# EasyEDA Pro project ICM42688-P.epro

# Schematic RareCheese
Create Date: 2023-12-05; Page Name: ICM42688; Project Name: SlimeVR-CheeseCake; Schematic Name: RareCheese; Update Date: 2023-12-05; Company: Designed by SoraKage; Page Size: A4; Version: V2.3
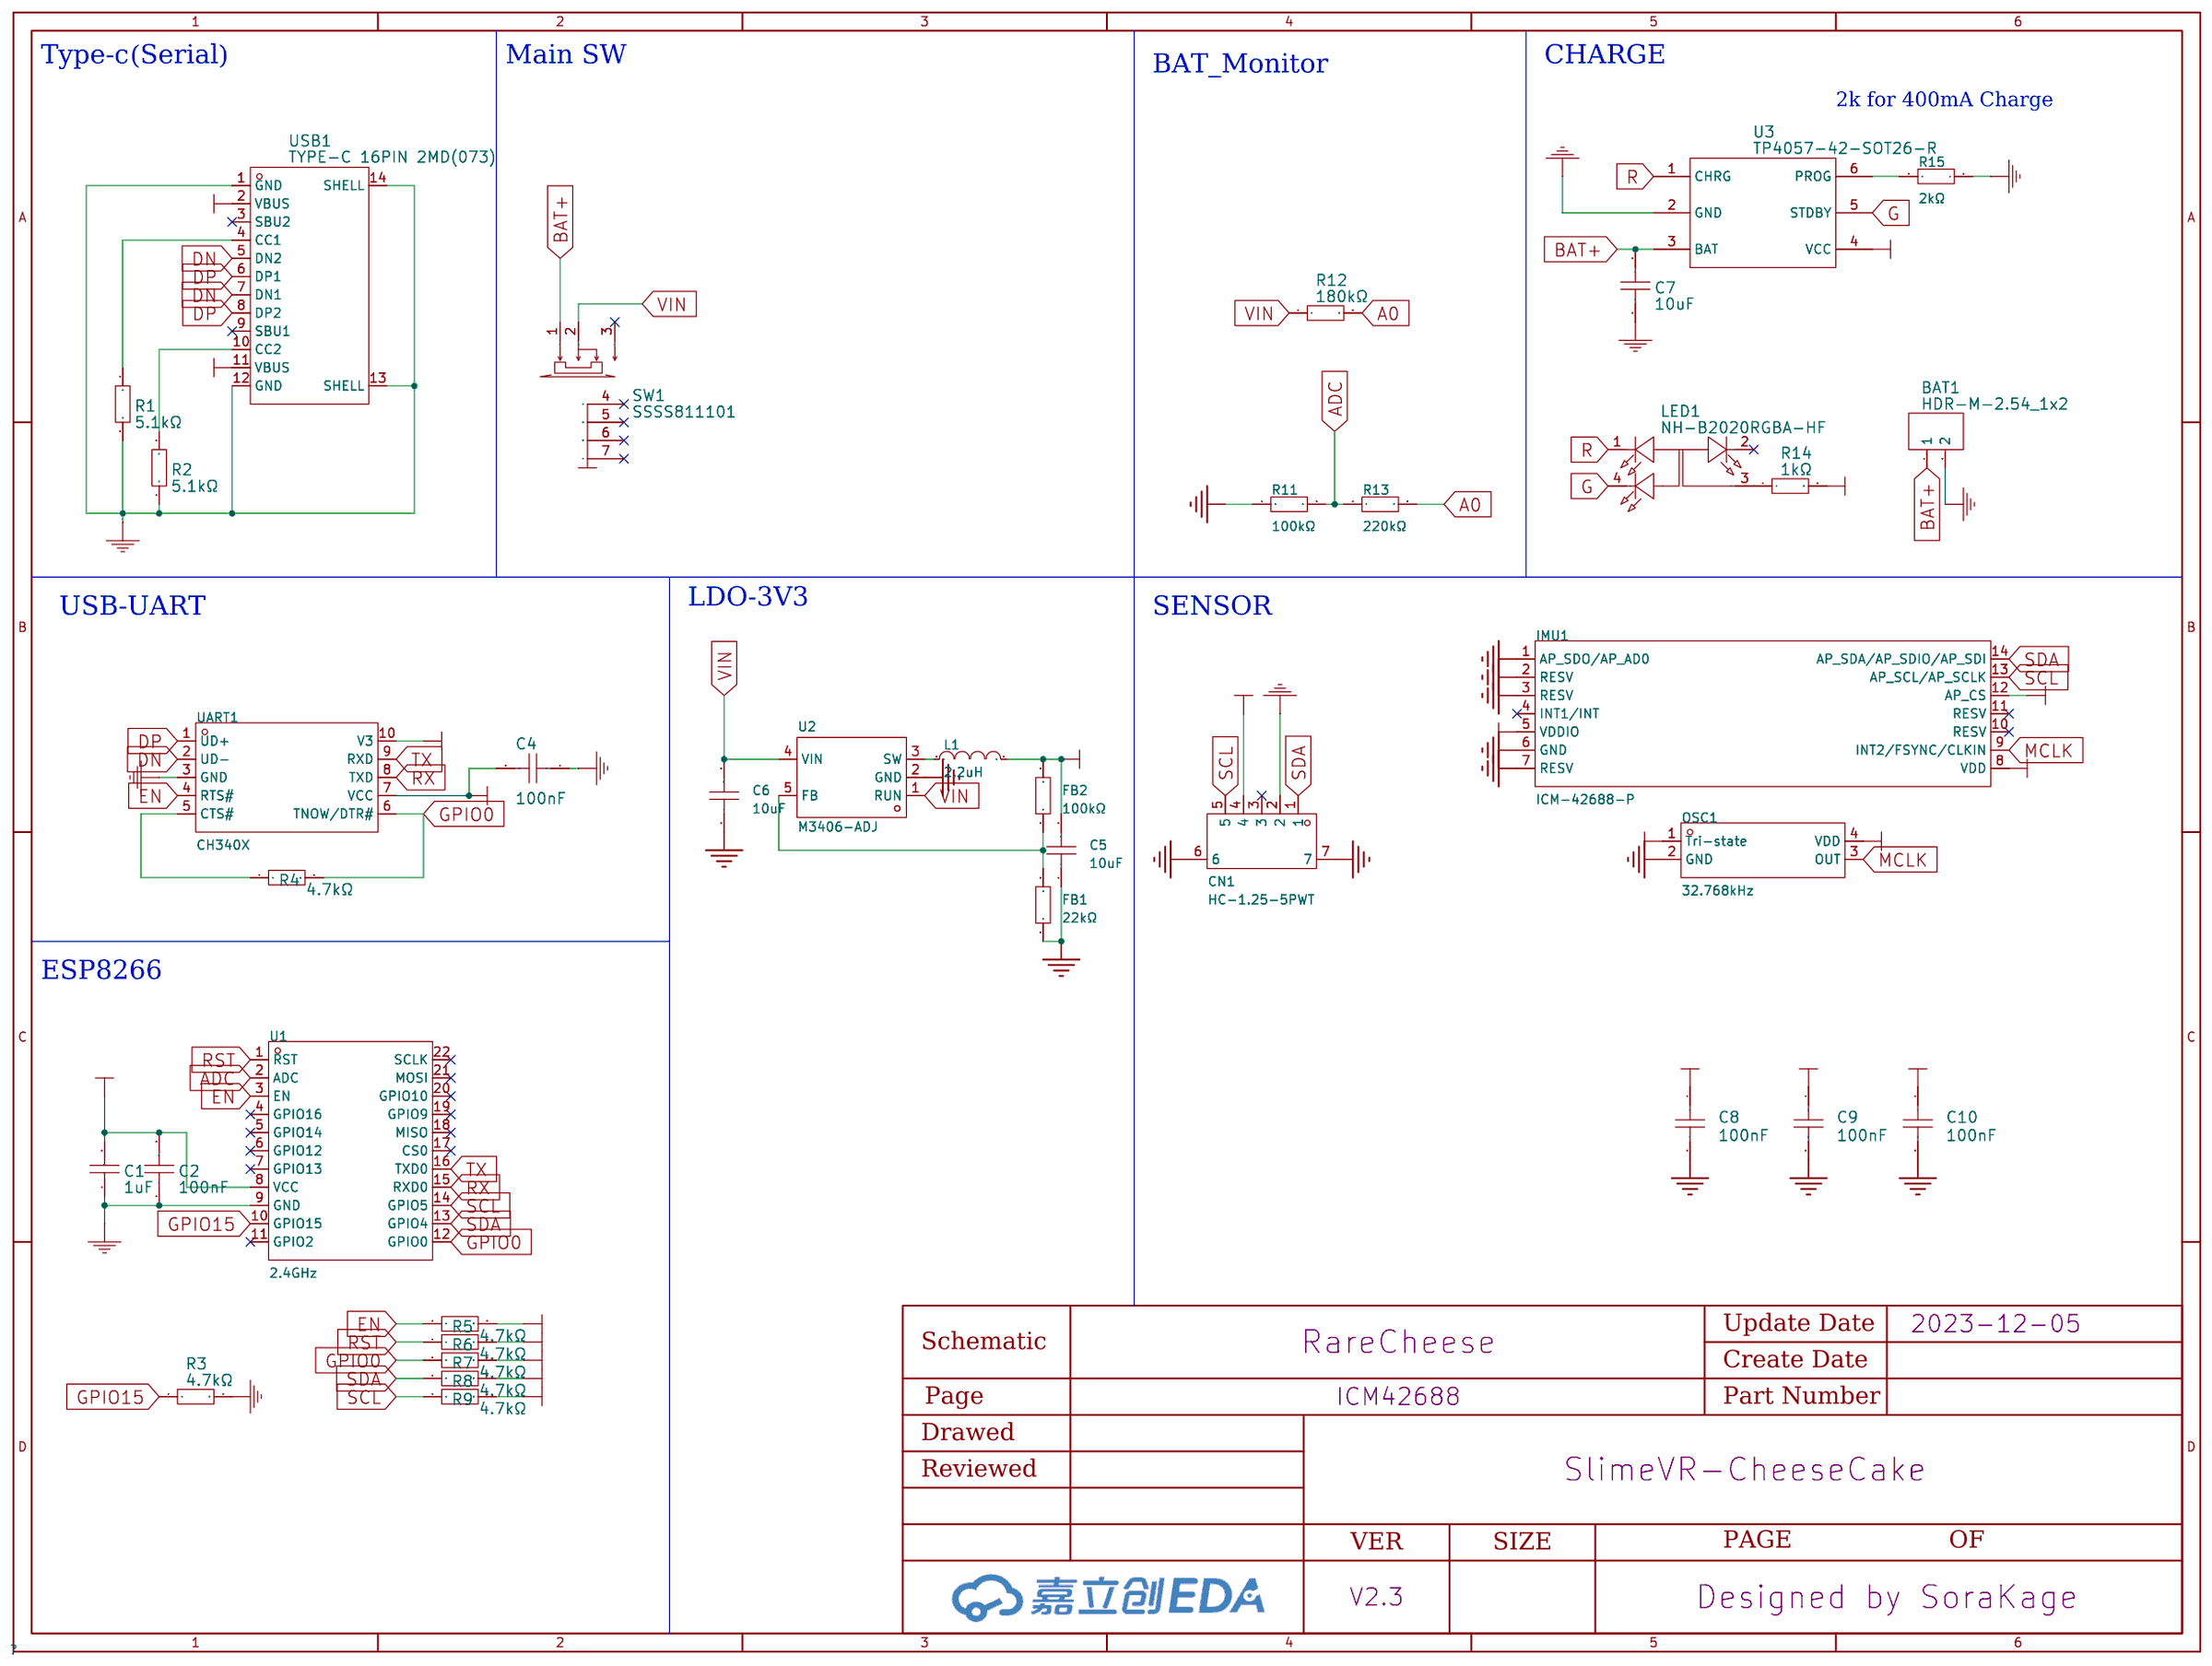
[diagram p0: schematic sheet]

## Parts
BAT1  HDR-M-2.54_1x2  [HDR-M-2.54_1X2]
C1  1uF  [C0603]
C2  100nF  [C0603]
C4  100nF  [C0603]
C5  10uF  [C0603]
C6  10uF  [C0603]
C7  10uF  [C0603]
C8  100nF  [C0603]
C9  100nF  [C0603]
C10  100nF  [C0603]
CN1  HC-1.25-5PWT  [CONN-SMD_5P-P1.25_HCTL_HC-1.25-5PWT]
FB1  22kΩ  [R0402]
FB2  100kΩ  [R0402]
IMU1  ICM-42688-P  [LGA-14_L3.0-W2.5-P0.50-TL]
L1  2.2uH  [IND-SMD_L2.5-W2.0_YXMBL252010P]
LED1  NH-B2020RGBA-HF  [LED-ARRAY-SMD_4P-L2.1-W2.1-TL_NH-B2020RGBA]
OSC1  32.768kHz  [OSC-SMD_4P-L3.2-W2.5-BL]
R1  5.1kΩ  [R0603]
R2  5.1kΩ  [R0603]
R3  4.7kΩ  [R0603]
R4  4.7kΩ  [R0603]
R5  4.7kΩ  [R0603]
R6  4.7kΩ  [R0603]
R7  4.7kΩ  [R0603]
R8  4.7kΩ  [R0603]
R9  4.7kΩ  [R0603]
R11  100kΩ  [R0603]
R12  180kΩ  [R0603]
R13  220kΩ  [R0603]
R14  1kΩ  [R0603]
R15  2kΩ  [R0603]
SW1  SSSS811101  [SW-SMD_SSSS811101]
U1  2.4GHz  [WIFIM-SMD_ESP-12F-ESP8266MOD]
U2  M3406-ADJ  [SOT-23-5_L3.0-W1.7-P0.95-LS2.8-BR]
U3  TP4057-42-SOT26-R  [SOT-23-6_L2.9-W1.6-P0.95-LS2.8-BL]
UART1  CH340X  [MSOP-10_L3.0-W3.0-P0.50-LS5.0-BL]
USB1  TYPE-C 16PIN 2MD(073)  [USB-C-SMD_TYPE-C-6PIN-2MD-073]

## Library data of the parts
BAT1 = HDR-M-2.54_1x2: Supplier Part: C124375; Supplier: LCSC
C1 = 1uF: link: https://item.szlcsc.com/362304.html; 3DModel: C0603_L1.6-W0.8-H0.8; Supplier: LCSC; Manufacturer Part: CL10A105KB8NNNC; Manufacturer: SAMSUNG(三星); Supplier Part: C15849; JLCPCB Part Class: Basic Part
C2 C4 C8-C10 = 100nF: link: https://item.szlcsc.com/362304.html; 3DModel: C0603_L1.6-W0.8-H0.8; Supplier: LCSC; Manufacturer: YAGEO(国巨); Manufacturer Part: CC0603KRX7R9BB104; Supplier Part: C14663; JLCPCB Part Class: Basic Part
C5 C6 = CL10A106KP8NNNC: 容值:10uF;精度:±10%;额定电压:10V;材质(温度系数):X5R;; LCSC Part Name: 10uF ±10% 10V; Supplier Part: C19702; Manufacturer: SAMSUNG(三星); Supplier Footprint: 0603; JLCPCB Part Class: 基础库; Datasheet: https://atta.szlcsc.com/upload/public/pdf/source/20160103/1457707703378.pdf; Supplier: LCSC; Tolerance: ±10%; Voltage Rated: 10V; Temperature Coefficient: X5R
C7 = 10uF: link: https://item.szlcsc.com/362304.html; 3DModel: C0603_L1.6-W0.8-H0.8; Supplier: LCSC; Manufacturer: SAMSUNG(三星); Manufacturer Part: CL10A106KP8NNNC; Supplier Part: C19702; JLCPCB Part Class: Basic Part
CN1 = HC-1.25-5PWT: 参考系列:-;间距:1.25mm;插针结构:1x5P;排数:1;每排PIN数:5;行距:-;公母:公型插针;安装方式:卧贴;额定电流:1A;工作温度范围:-25℃~+85℃;; LCSC Part Name: 1.25mm 1x5P 卧贴; Supplier Part: C2845382; Manufacturer: HCTL(华灿天禄); Supplier Footprint: SMD,P=1.25mm; JLCPCB Part Class: Extended Part; Datasheet: https://atta.szlcsc.com/upload/public/pdf/source/20210728/C2845379_48B7DC28A4B35DB030A7253F7C3FD974.pdf; Supplier: LCSC; Pitch: 1.25mm; Pins Structure: 1x5P; Number of Rows: 1; Number of PINs Per Row: 5; Gender: 公型插针; Mounting Style: 卧贴; Current Rating (Max): 1A; Operating Temperature Range: -25℃~+85℃; NO_CONNECT: yes
FB1 = 0402WGF2202TCE: 电阻类型:厚膜电阻;阻值:22kΩ;精度:±1%;功率:62.5mW;; LCSC Part Name: 22kΩ ±1% 62.5mW; Supplier Part: C25768; Manufacturer: UNI-ROYAL(厚声); Supplier Footprint: 0402; JLCPCB Part Class: 基础库; Datasheet: https://atta.szlcsc.com/upload/public/pdf/source/20200306/C422600_1E6D84923E4A46A82E41ADD87F860B5C.pdf; Supplier: LCSC; Type: 厚膜电阻; Tolerance: ±1%; Power(Watts): 62.5mW; Temperature Coefficient: ±100ppm/℃; Overload Voltage (Max): 50V; Operating Temperature Range: -55℃~+155℃
FB2 = 0402WGF1003TCE: 电阻类型:厚膜电阻;阻值:100kΩ;精度:±1%;功率:62.5mW;; LCSC Part Name: 100kΩ ±1% 62.5mW; Supplier Part: C25741; Manufacturer: UNI-ROYAL(厚声); Supplier Footprint: 0402; JLCPCB Part Class: 基础库; Datasheet: https://atta.szlcsc.com/upload/public/pdf/source/20200306/C422600_1E6D84923E4A46A82E41ADD87F860B5C.pdf; Supplier: LCSC; Type: 厚膜电阻; Tolerance: ±1%; Power(Watts): 62.5mW; Temperature Coefficient: ±100ppm/℃; Overload Voltage (Max): 50V; Operating Temperature Range: -55℃~+155℃
IMU1 = ICM-42688-P: LCSC Part Name: ICM 42688 P; Supplier Part: C1850418; Manufacturer: TDK InvenSense(应美盛); Supplier Footprint: LGA-14(2.5x3); JLCPCB Part Class: 扩展库; Datasheet: https://atta.szlcsc.com/upload/public/pdf/source/20210703/CF24204867ACE5B754A2B035F23E5931.pdf; Supplier: LCSC
L1 = APH252010T2R2M: 类型:一体成型电感;电感值:2.2uH;精度:±20%;额定电流:2.1A;饱和电流(Isat):3A;; LCSC Part Name: 2.2uH ±20% 3A; Supplier Part: C5349606; Manufacturer: APV(爱普微); Supplier Footprint: L252010; JLCPCB Part Class: 扩展库; Datasheet: https://atta.szlcsc.com/upload/public/pdf/source/20230112/CD71A991BF44148C80048C09E1A9BC6B.pdf; Supplier: LCSC; Type: 一体成型电感; Tolerance: ±20%; Rated Current: 2.1A; Saturation Current (Isat): 3A; DC Resistance (DCR): 70mΩ
LED1 = NH-B2020RGBA-HF: link: https://atta.szlcsc.com/upload/public/pdf/source/20210810/F2CC95523506BC87574AF0308E7F77A3.pdf; Supplier: LCSC; Supplier Part: C2874116; Manufacturer: 国星光电; JLCPCB Part Class: Extended Part
OSC1 = OK2EL89CJI-111YLC-32.768K: 频率:32.768kHz;工作电压:1.8V~3.3V;; LCSC Part Name: 32.768KHZ 1.8V-3.3V ±10PPM YSO120TK; Supplier Part: C5280579; Manufacturer: YXC(扬兴晶振); Supplier Footprint: SMD3225-4P; JLCPCB Part Class: 扩展库; Datasheet: https://atta.szlcsc.com/upload/public/pdf/source/20221123/314DEFB66F8D0824EF78ADB5B539B6E4.pdf; Supplier: LCSC; Supply Voltage: 1.8V~3.3V
R1 R2 = 5.1kΩ: 3DModel: R0603_L1.6-W0.8-H0.8; link: https://www.mouser.in/datasheet/2/447/PYu_RT_1_to_0_01_RoHS_L_11-1669912.pdf; Supplier: LCSC; Manufacturer Part: 0603WAF5101T5E; Manufacturer: UNI-ROYAL(厚声); Supplier Part: C23186; Resistance: 5.1K; JLCPCB Part Class: Basic Part
R3 R5-R7 = 4.7kΩ: 3DModel: R0603_L1.6-W0.8-H0.8; link: https://www.mouser.in/datasheet/2/447/PYu_RT_1_to_0_01_RoHS_L_11-1669912.pdf; Supplier: LCSC; Manufacturer: UNI-ROYAL(厚声); Manufacturer Part: 0603WAF4701T5E; Supplier Part: C23162; Resistance: 4.7K; JLCPCB Part Class: Basic Part
R4 R8 R9 = 0603WAF4701T5E: Supplier: LCSC; Manufacturer: UNI-ROYAL(厚声); Supplier Part: C23162; Resistance: 4.7K; JLCPCB Part Class: Basic Part
R11 = 0603WAF1003T5E: 电阻类型:厚膜电阻;阻值:100kΩ;精度:±1%;功率:100mW;; LCSC Part Name: 100kΩ ±1% 100mW; Supplier Part: C25803; Manufacturer: UNI-ROYAL(厚声); Supplier Footprint: 0603; JLCPCB Part Class: Basic Part; Datasheet: https://atta.szlcsc.com/upload/public/pdf/source/20200306/C422600_1E6D84923E4A46A82E41ADD87F860B5C.pdf; Supplier: LCSC; Type: 厚膜电阻; Tolerance: ±1%; Power(Watts): 100mW; Temperature Coefficient: ±100ppm/℃; Overload Voltage (Max): 75V; Operating Temperature Range: -55℃~+155℃
R12 = 180kΩ: 3DModel: R0603_L1.6-W0.8-H0.8; link: https://www.mouser.in/datasheet/2/447/PYu_RT_1_to_0_01_RoHS_L_11-1669912.pdf; Supplier: LCSC; Manufacturer: UNI-ROYAL(厚声); Manufacturer Part: 0603WAF1803T5E; Supplier Part: C22827; Resistance: 180K; JLCPCB Part Class: Basic Part
R13 = 0603WAF2203T5E: 电阻类型:厚膜电阻;阻值:220kΩ;精度:±1%;功率:100mW;; LCSC Part Name: 220kΩ ±1% 100mW; Supplier Part: C22961; Manufacturer: UNI-ROYAL(厚声); Supplier Footprint: 0603; JLCPCB Part Class: Basic Part; Datasheet: https://atta.szlcsc.com/upload/public/pdf/source/20200306/C422600_1E6D84923E4A46A82E41ADD87F860B5C.pdf; Supplier: LCSC; Type: 厚膜电阻; Tolerance: ±1%; Power(Watts): 100mW; Temperature Coefficient: ±100ppm/℃; Overload Voltage (Max): 75V; Operating Temperature Range: -55℃~+155℃
R14 = 1kΩ: 3DModel: R0603_L1.6-W0.8-H0.8; link: https://www.mouser.in/datasheet/2/447/PYu_RT_1_to_0_01_RoHS_L_11-1669912.pdf; Supplier: LCSC; Manufacturer: UNI-ROYAL(厚声); Manufacturer Part: 0603WAF1001T5E; Supplier Part: C21190; Resistance: 1K; JLCPCB Part Class: Basic Part
R15 = 0603WAF2001T5E: 电阻类型:厚膜电阻;阻值:2kΩ;精度:±1%;功率:100mW;; LCSC Part Name: 2kΩ ±1% 100mW; Supplier Part: C22975; Manufacturer: UNI-ROYAL(厚声); Supplier Footprint: 0603; JLCPCB Part Class: Basic Part; Datasheet: https://atta.szlcsc.com/upload/public/pdf/source/20200306/C422600_1E6D84923E4A46A82E41ADD87F860B5C.pdf; Supplier: LCSC; Type: 厚膜电阻; Tolerance: ±1%; Power(Watts): 100mW; Temperature Coefficient: ±100ppm/℃; Overload Voltage (Max): 75V; Operating Temperature Range: -55℃~+155℃
SW1 = SSSS811101: link: https://item.szlcsc.com/110556.html; 3DModel: SW-TH_SSSS811101; Supplier: LCSC; Manufacturer: ALPSALPINE(阿尔卑斯阿尔派); Supplier Part: C109335; JLCPCB Part Class: Extended Part
U1 = ESP-12F(ESP8266MOD): 频率:2.4GHz;发射功率:16dBm;核心处理器:ESP8266;天线形式:PCB 板载天线;接收灵敏度:-90dBm;; Supplier Part: C82891; Manufacturer: Ai-Thinker(安信可); Supplier Footprint: SMD,16x24mm; JLCPCB Part Class: Extended Part; Datasheet: https://atta.szlcsc.com/upload/public/pdf/source/20210219/C82891_ABD84A460F4F056A2757267CCCA4B508.pdf; Supplier: LCSC; Output Power: 16dBm; Core Processor: ESP8266; Support Interface: GPIO；UART；I2C；PWM；SPI；ADC; Antenna Type: PCB 板载天线; Wireless Standard: 802.11b/g/n; Operating Voltage: 3.3V; Receive  Current: 120mA; Send  Current: 170mA; Sensitivity: -90dBm; Operating Temperature: -40℃~+85℃
U2 = M3406-ADJ: 功能类型:降压型;同步整流:-;输出通道数:-;拓扑结构:-;输入电压:-;输出电流(最大值):-;开关频率:-;; LCSC Part Name: 降压型; Supplier Part: C83224; Manufacturer: 西安航天民芯; Supplier Footprint: SOT-23-5; JLCPCB Part Class: 扩展库; Datasheet: https://atta.szlcsc.com/upload/public/pdf/source/20161110/1478742836232.pdf; Supplier: LCSC; Function: 降压型
U3 = TP4057-42-SOT26-R: LCSC Part Name: TP4057 1%; Supplier Part: C12044; Manufacturer: TOPPOWER(南京拓微); Supplier Footprint: SOT-23-6; JLCPCB Part Class: Basic Part; Datasheet: https://atta.szlcsc.com/upload/public/pdf/source/20140228/1457706997013.pdf; Supplier: LCSC
UART1 = CH340X: Supplier Part: C3035748; Manufacturer: WCH(南京沁恒); Supplier Footprint: MSOP-10; JLCPCB Part Class: Extended Part; Supplier: LCSC
USB1 = TYPE-C 16PIN 2MD(073): link: https://atta.szlcsc.com/upload/public/pdf/source/20210409/C2765186_34D42616F62DF94D17C4D63D74D9FD03.pdf; Supplier: LCSC; Supplier Part: C2765186; Manufacturer: SHOU HAN(首韩); JLCPCB Part Class: Extended Part

## Nets
3V3: C1.2 C2.2 C4.2 C5.2 C8.1 C9.1 C10.1 CN1.4 FB2.2 IMU1.5(VDDIO) IMU1.8(VDD) IMU1.12(AP_CS) L1.2 OSC1.1(Tri-state) OSC1.4(VDD) R5.2 R6.2 R7.2 R8.2 R9.2 U1.8(VCC) UART1.7(VCC) UART1.10(V3)
+5V: R14.2 U3.4(VCC) USB1.2(VBUS) USB1.11(VBUS)
GND: BAT1.2 C1.1 C2.1 C4.1 C5.1 C6.1 C7.1 C8.2 C9.2 C10.2 CN1.2 CN1.6 CN1.7 FB1.1 IMU1.1(AP_SDO/AP_AD0) IMU1.2(RESV) IMU1.3(RESV) IMU1.6(GND) IMU1.7(RESV) OSC1.2(GND) R1.1 R2.1 R3.2 R11.1 R15.2 U1.9(GND) U2.2(GND) U3.2(GND) UART1.3(GND) USB1.1(GND) USB1.12(GND) USB1.13(SHELL) USB1.14(SHELL)
VIN: C6.2 R12.1 SW1.2 U2.1(RUN) U2.4(VIN)
A0: R12.2 R13.2
ADC: R11.2 R13.1 U1.2(ADC)
BAT+: BAT1.1 C7.2 SW1.1 U3.3(BAT)
DN: UART1.2(UD-) USB1.5(DN2) USB1.7(DN1)
DP: UART1.1(UD+) USB1.6(DP1) USB1.8(DP2)
EN: R5.1 U1.3(EN) UART1.4(RTS#)
G: LED1.4(-) U3.5(STDBY)
GPIO0: R4.2 R7.1 U1.12(GPIO0) UART1.6(TNOW/DTR#)
GPIO15: R3.1 U1.10(GPIO15)
MCLK: IMU1.9(INT2/FSYNC/CLKIN) OSC1.3(OUT)
R: LED1.1(-) U3.1(CHRG)
RST: R6.1 U1.1(RST)
RX: U1.15(RXD0) UART1.8(TXD)
SCL: CN1.5 IMU1.13(AP_SCL/AP_SCLK) R9.1 U1.14(GPIO5)
SDA: CN1.1 IMU1.14(AP_SDA/AP_SDIO/AP_SDI) R8.1 U1.13(GPIO4)
TX: U1.16(TXD0) UART1.9(RXD)
$1N6016: R1.2 USB1.4(CC1)
$1N6017: R2.2 USB1.10(CC2)
$1N6024: R15.1 U3.6(PROG)
$1N6098: LED1.3(+) R14.1
$1N22824: R4.1 UART1.5(CTS#)
$1N30728: L1.1 U2.3(SW)
$1N30734: FB1.2 FB2.1 U2.5(FB)

Not connected (* = marked no-connect by the designer): CN1 3*; IMU1 4(INT1/INT)* 10(RESV)* 11(RESV)*; LED1 2(-)*; SW1 3* 4* 5* 6* 7*; U1 4(GPIO16)* 5(GPIO14)* 6(GPIO12)* 7(GPIO13)* 11(GPIO2)* 17(CS0)* 18(MISO)* 19(GPIO9)* 20(GPIO10)* 21(MOSI)* 22(SCLK)*; USB1 3(SBU2)* 9(SBU1)*

## Notes on the sheet
- Type-c(Serial)
- Main SW
- BAT_Monitor
- CHARGE
- 2k for 400mA Charge
- USB-UART
- LDO-3V3
- SENSOR
- ESP8266

# Board ICM42688
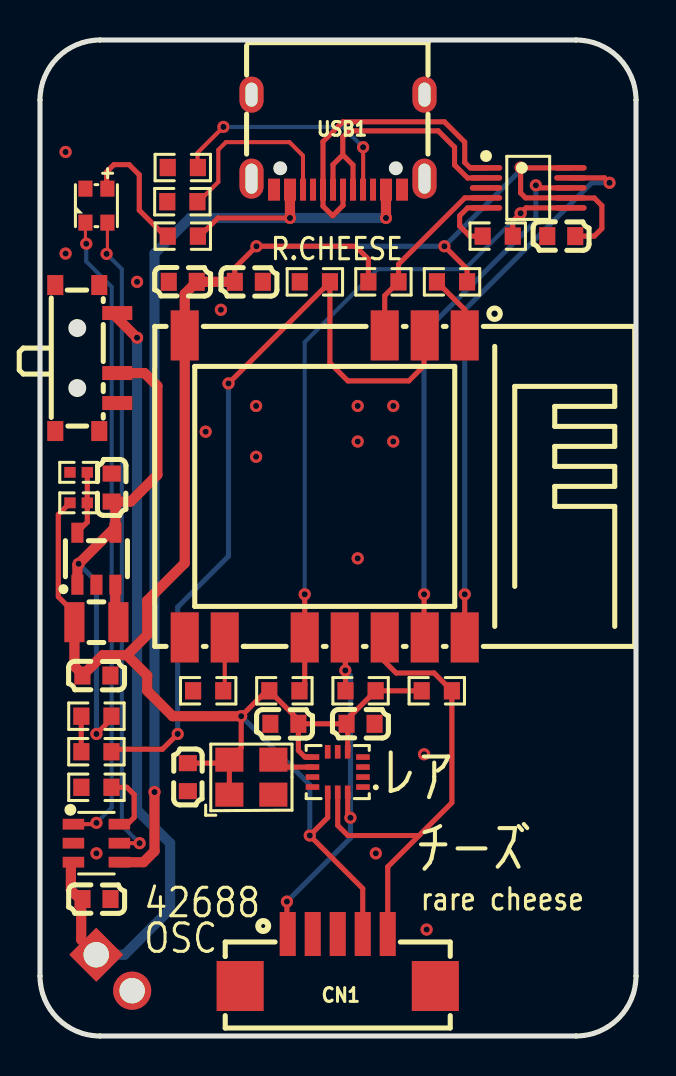
[diagram p1: board, top side]
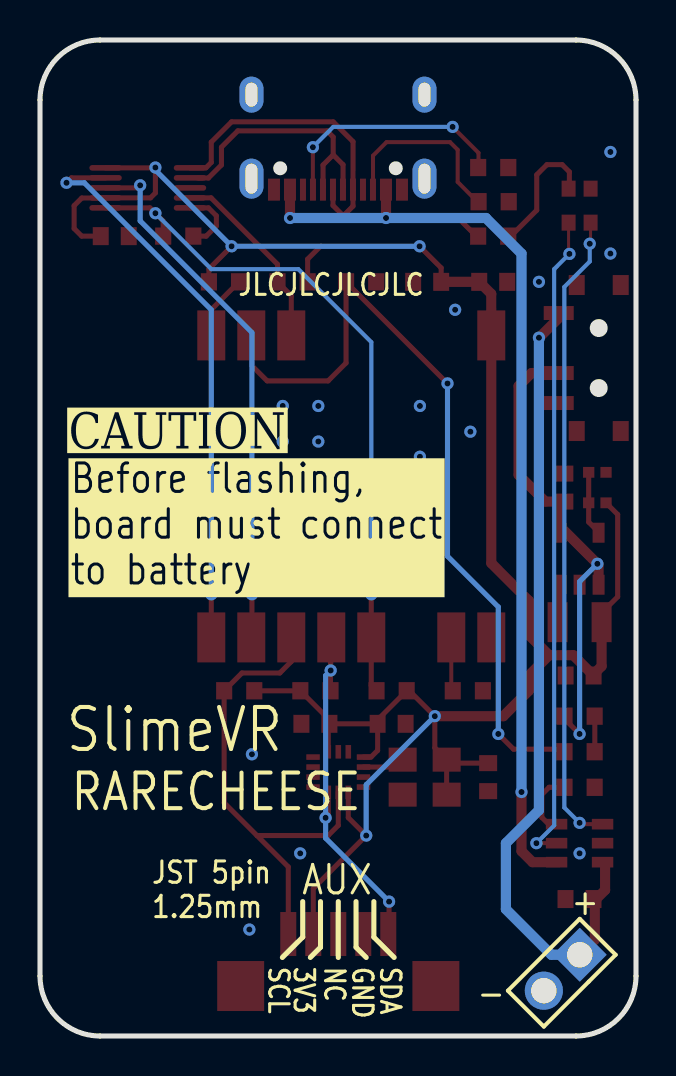
[diagram p2: board, bottom side, seen from below]

Outline 29.8 x 49.8 mm; copper layers: Top Layer, Bottom Layer. Coordinates in mm from the lower left corner of the outline.
Outline path: 0,46.8 0,3 arc(0.88,0.88) 3,0 26.8,0 arc(28.92,0.88) 29.8,3 29.8,46.8 arc(28.92,48.92) 26.8,49.8 3,49.8 arc(0.88,48.92) 0,46.8
Stack: Top Layer 0.035mm / Dielectric1 0.91mm FR4 er 4.5 / Bottom Layer 0.035mm

## Design rules (mm)
spacing Default (default): track to track 0.127, other pairs 0 to 0.127
track width Default (default): min 0.127, default 0.127, max 25.4
differential pair differentialPair (default): width min 0.127, default 0.254, max 2.54; gap min 0.152, default 0.152
via Default (default): diameter min 0.61, default 0.61, max 100.025; hole min 0.305, default 0.305, max 59.995
net GND uses gge20888(1)

## Placement (name value [footprint] x y rotation side)
BAT1  HDR-M-2.54_1x2  [hdr-m-2.54_1x2]  3.71 3.16 315 bottom
C1  1uF  [C0603]  7.14 37.71 0 top
C2  100nF  [C0603]  10.44 37.71 180 top
C4  100nF  [C0603]  26.06 39.99 0 top
C5  10uF  [C0603]  2.82 18.02 180 top
C6  10uF  [C0603]  3.58 27.42 270 top
C7  10uF  [C0603]  2.82 6.85 180 top
C8  100nF  [C0603]  12.22 15.61 180 top
C9  100nF  [C0603]  7.39 12.94 270 top
C10  100nF  [C0603]  16.03 15.61 0 top
CN1  HC-1.25-5PWT  [CONN-SMD_5P-P1.25_HCTL_HC-1.25-5PWT]  14.89 3.8 0 top
FB1  22kΩ  [R0402]  1.93 28.18 0 top
FB2  100kΩ  [R0402]  1.93 26.66 180 top
IMU1  ICM-42688-P  [LGA-14_L3.0-W2.5-P0.50-TL]  14.89 13.2 180 top
L1  2.2uH  [IND-SMD_L2.5-W2.0_YXMBL252010P]  2.82 20.69 0 top
LED1  NH-B2020RGBA-HF  [LED-ARRAY-SMD_4P-L2.1-W2.1-TL_NH-B2020RGBA]  2.82 41.52 90 top
OSC1  32.768kHz  [OSC-SMD_4P-L3.2-W2.5-BL]  10.57 12.94 0 top
R1  5.1kΩ  [R0603]  7.14 43.42 0 top
R2  5.1kΩ  [R0603]  7.12 41.72 0 top
R3  4.7kΩ  [R0603]  8.41 17.26 180 top
R4  4.7kΩ  [R0603]  22.89 39.99 0 top
R5  4.7kΩ  [R0603]  17.17 37.71 180 top
R6  4.7kΩ  [R0603]  20.6 37.71 0 top
R7  4.7kΩ  [R0603]  12.22 17.26 180 top
R8  4.7kΩ  [R0603]  16.03 17.26 0 top
R9  4.7kΩ  [R0603]  19.84 17.26 180 top
R11  100kΩ  [R0603]  13.74 37.71 0 top
R12  180kΩ  [R0603]  2.82 15.99 180 top
R13  220kΩ  [R0603]  2.82 14.21 180 top
R14  1kΩ  [R0603]  7.14 39.99 0 top
R15  2kΩ  [R0603]  2.82 12.44 180 top
SW1  SSSS811101  [SW-SMD_SSSS811101]  2.31 33.9 270 top
U1  2.4GHz  [WIFIM-SMD_ESP-12F-ESP8266MOD]  13.59 27.48 180 top
U2  M3406-ADJ  [SOT-23-5_L3.0-W1.7-P0.95-LS2.8-BR]  2.82 23.87 270 top
U3  TP4057-42-SOT26-R  [SOT-23-6_L2.9-W1.6-P0.95-LS2.8-BL]  2.82 9.64 270 top
UART1  CH340X  [MSOP-10_L3.0-W3.0-P0.50-LS5.0-BL]  24.41 42.41 270 top
USB1  TYPE-C 16PIN 2MD(073)  [USB-C-SMD_TYPE-C-6PIN-2MD-073]  14.9 44.69 180 top

## Footprints (pads in the part's own frame, mm; a bottom-side part is the same pattern mirrored in y, then rotated)
C0603
  rect 0.8x0.9 smd: 1(-0.7,0) 2(0.7,0)
CONN-SMD_5P-P1.25_HCTL_HC-1.25-5PWT
  rect 0.8x2.2 smd: 1(-2.5,1.3) 2(-1.25,1.3) 3(0,1.3) 4(1.25,1.3) 5(2.5,1.3)
  rect 2.35x2.5 smd: 6(4.88,-1.3) 7(-4.88,-1.3)
hdr-m-2.54_1x2
  rect 1.905x1.905 hole 1.27x1.021: 1(-1.27,0)
  round 1.905 hole 1.27x1.021: 2(1.27,0)
IND-SMD_L2.5-W2.0_YXMBL252010P
  rect 1x2 smd: 1(1.1,0) 2(-1.1,0)
LED-ARRAY-SMD_4P-L2.1-W2.1-TL_NH-B2020RGBA
  rect 0.8x0.7 smd: 1(-0.85,0.55) 2(0.85,0.55) 3(0.85,-0.55) 4(-0.85,-0.55)
LGA-14_L3.0-W2.5-P0.50-TL
  rect 0.675x0.28 smd: 1(-1.262,0.75) 2(-1.262,0.25) 3(-1.262,-0.25) 4(-1.262,-0.75) 8(1.262,-0.75) 9(1.262,-0.25) 10(1.262,0.25) 11(1.262,0.75)
  rect 0.28x0.675 smd: 5(-0.5,-1.012) 6(0,-1.012) 7(0.5,-1.012) 12(0.5,1.012) 13(0,1.012) 14(-0.5,1.012)
MSOP-10_L3.0-W3.0-P0.50-LS5.0-BL
  oval 0.28x1.62 smd: 1(-1,-2.11) 2(-0.5,-2.11) 3(0,-2.11) 4(0.5,-2.11) 5(1,-2.11) 6(1,2.11) 7(0.5,2.11) 8(0,2.11) 9(-0.5,2.11) 10(-1,2.11)
OSC-SMD_4P-L3.2-W2.5-BL
  rect 1.4x1.2 smd: 1(-1.1,-0.875) 2(1.1,-0.875) 3(1.1,0.875) 4(-1.1,0.875)
R0402
  rect 0.566x0.54 smd: 1(-0.433,0) 2(0.433,0)
R0603
  rect 0.806x0.864 smd: 1(-0.753,0) 2(0.753,0)
SOT-23-5_L3.0-W1.7-P0.95-LS2.8-BR
  rect 1x0.6 smd: 1(1.3,-0.95) 2(1.3,0) 3(1.3,0.95) 4(-1.3,0.95) 5(-1.3,-0.95)
SOT-23-6_L2.9-W1.6-P0.95-LS2.8-BL
  rect 0.532x1.072 smd: 1(-0.95,-1.149) 2(0,-1.149) 3(0.95,-1.149) 4(0.95,1.149) 5(0,1.149) 6(-0.95,1.149)
SW-SMD_SSSS811101
  rect 0.7x1.5 smd: 1(-2.25,1.55) 2(0.75,1.55) 3(2.25,1.55)
  rect 1x0.8 smd: 4(-3.65,0.65) 5(3.65,0.65) 6(3.65,-1.55) 7(-3.65,-1.55)
USB-C-SMD_TYPE-C-6PIN-2MD-073
  rect 0.6x1.1 smd: 1(-3.2,2.375) 2(-2.4,2.375) 11(2.4,2.375) 12(3.2,2.375)
  rect 0.3x1.1 smd: 3(-1.75,2.375) 4(-1.25,2.375) 5(-0.75,2.375) 6(-0.25,2.375) 7(0.25,2.375) 8(0.75,2.375) 9(1.25,2.375) 10(1.75,2.375)
  oval 1.2x2 hole 0.6x1.5: 13(-4.325,1.825) 14(4.325,1.825)
  oval 1.2x1.8 hole 0.6x1.2: 15(-4.325,-2.375) 16(4.325,-2.375)
WIFIM-SMD_ESP-12F-ESP8266MOD
  rect 1.4x2.5 smd: 1(-7.651,-7.551) 2(-5.651,-7.551) 3(-3.651,-7.551) 8(6.349,-7.551) 9(6.349,7.548) 10(4.349,7.55) 12(0.349,7.551) 13(-1.651,7.55) 14(-3.651,7.551) 15(-5.651,7.551) 16(-7.651,7.551)

## Nets
As in the schematic.

Pads without a net: CN1 3; IMU1 4 10 11; LED1 2; SW1 3 4 5 6 7; USB1 3 9 15 16

## Via types
v1: diameter 0.61, hole 0.305, Top Layer to Bottom Layer, 44 vias

## Routing (per net, layer and track width the routed paths; a pad name or vN(x,y) marks a point on that pad's centre or on a via; arc(x,y) is an arc through that point)
3V3: length 115.7
  Top Layer w0.254: CN1.4 16.14,7.38 v1(13.49,10.02) 14.39,10.92 IMU1.12 ; R5.2 16.42,38.84 15.78,39.49 v1(10.82,39.49) 9.74,38.41 C2.2 ; IMU1.8 13.25,13.95 12.92,14.28 12.92,15.61 ; 12.92,15.61 15.13,15.61 15.39,15.86 ; 12.92,15.61 12.92,15.81 R7.2 11.33,17.26 v1(10.06,15.99) 10.06,14.41 OSC1.4 ; R9.2 R8.2 15.39,15.86 ; 15.39,15.86 15.39,15.55 ; OSC1.4 OSC1.1 ; OSC1.4 9.29,13.64 C9.1 ; 15.39,15.55 IMU1.5 ; 15.39,15.55 C10.1 ; L1.2 1.72,21.16 0.92,21.96 0.92,26.08 FB2.2 ; C4.2 27.71,39.99 28.09,40.38 28.09,41.52 27.71,41.9 26.53,41.9 UART1.7 ; 26.51,41.9 UART1.7 ; UART1.7 24.28,41.91 24.03,42.15 v1(24.03,43.42) 24.05,43.41 UART1.10 ; R6.2 21.35,38.35 v1(20.22,39.49)
  Top Layer w0.508: 9.61,37.71 C1.2 7.24,37.11 7.24,35.03 7.24,23.64 5.36,21.77 5.36,20.06 4.34,19.04 ; 4.34,19.04 3.14,19.04 C5.2 2.12,18.09 1.72,18.49 L1.2 ; 4.34,19.04 5.36,18.02 5.36,17.26 6.63,15.99 v1(10.06,15.99)
  Bottom Layer w0.254: v1(13.49,10.02) 13.49,12.56 v1(10.06,15.99) ; v1(24.03,43.42) 24.03,43.3 20.22,39.49 10.82,39.49
+5V: length 52.2
  Top Layer w0.254: 7.88,39.88 8.89,40.9 v1(12.5,40.9)
  Top Layer w0.508: v1(5.72,12.2) 5.72,9.24 5.17,8.69 3.84,8.69 ; USB1.11 v1(12.5,40.9) ; USB1.2 v1(17.3,40.9)
  Bottom Layer w0.508: v1(5.72,12.2) 5.72,39.12 7.5,40.9 v1(12.5,40.9) v1(17.3,40.9)
GND:
  vias: v1(1.28,44.2) v1(1.28,39.12) v1(2.82,9.13) v1(4.85,37.71) v1(8.28,30.22) v1(9.04,36.31) v1(10.81,31.5) v1(10.81,28.96) v1(15.89,31.5) v1(15.89,29.72) v1(15.89,23.88) v1(16.79,9.13) v1(17.66,31.5) v1(17.66,29.72) v1(19.2,14.09) v1(19.33,5.32)
VIN: length 25
  Top Layer w0.254: v1(2.82,15.1) 3.57,15.86 3.57,16.25
  Top Layer w0.508: SW1.2 5.22,33.15 5.87,32.5 5.87,28.06 4.53,26.72 C6.2 3.77,26.53 3.77,25.45 v1(1.93,23.61) 1.87,23.55 1.87,22.44
  Bottom Layer w0.254: v1(1.93,23.61) 2.82,22.72 v1(2.82,15.1)
A0: length 1.9
  Top Layer w0.254: 2.07,14.34 2.06,14.35 2.06,16.24 2.07,16.25
ADC: length 40.4
  Top Layer w0.254: v1(6.89,15.1) 6.12,14.34 3.57,14.34 ; 14.5,37.7 14.5,33.65 15.39,32.76 18.44,32.76 19.2,33.52 19.2,35 U1.2 ; 14.5,37.7 v1(9.43,32.63) ; 14.5,37.7 R11.2
  Bottom Layer w0.254: v1(6.89,15.1) 6.89,21.45 9.43,23.99 v1(9.43,32.63)
BAT+: length 40.8
  Top Layer w0.508: 1.55,8.69 1.55,7.3 2.06,6.78 2.06,4.82 BAT1.1 ; 3.61,36.15 4.84,34.91 v1(4.85,34.91)
  Bottom Layer w0.508: v1(4.85,34.91) 4.85,11.29 6.5,9.64 6.5,6.34 4.23,4.06 BAT1.1
DN: length 12.9
  Top Layer w0.254: 15.64,42.45 15.65,42.46 15.65,43.55 15.14,44.06 ; 14.64,42.45 14.65,42.46 14.65,43.57 15.14,44.06 ; 15.14,44.06 15.14,44.95 15.45,45.26 19.91,45.26 20.73,44.44 20.73,43.55 21.38,42.9 21.91,42.9
DP: length 15.5
  Top Layer w0.254: UART1.1 21.51,43.41 21.24,43.68 21.24,44.69 20.22,45.71 15.14,45.71 14.15,44.72 14.15,42.32 14.15,41.49 14.63,41.01 15.15,41.53 15.15,42.32
EN: length 9.6
  Top Layer w0.254: U1.3 17.24,37.02 R5.1 17.93,38.59 21.24,41.91 UART1.4
G: length 33
  Top Layer w0.152: 3.37,40.8 3.37,39.15 v1(3.33,39.11)
  Top Layer w0.203: v1(4.98,9.64) 3.84,9.64
  Bottom Layer w0.203: v1(4.98,9.64) 4.09,10.53 4.09,38.34 v1(3.33,39.11)
GPIO0: length 34.9
  Top Layer w0.254: UART1.6 24.3,41.41 v1(24.03,41.14) 23.64,40.75 R4.2 ; R7.1 13.24,17.53 U1.12 13.24,22.09
  Bottom Layer w0.203: v1(13.24,22.09) 13.24,34.69 16.88,38.34 21.23,38.34 24.03,41.14
GPIO15: length 2.7
  Top Layer w0.203: 9.24,19.94 9.24,17.34 9.16,17.26
MCLK: length 2.1
  Top Layer w0.254: OSC1.3 12.04,13.45 IMU1.9
R: length 32.3
  Top Layer w0.152: 2.27,40.8 2.27,39.66 v1(2.31,39.61)
  Top Layer w0.203: 1.55,10.59 2.75,10.59 v1(2.82,10.66)
  Bottom Layer w0.203: 2.31,39.61 2.31,38.73 3.58,37.45 3.58,11.42 2.82,10.66
RST: length 3.3
  Top Layer w0.254: R6.1 21.24,36.32 U1.1
RX: length 26.7
  Top Layer w0.254: v1(24.79,42.53) 24.92,42.41 UART1.8 ; v1(19.2,22.09) 19.2,19.96 U1.15
  Bottom Layer w0.254: v1(19.2,22.09) 19.2,35.17 24.79,40.76 v1(24.79,42.53)
SCL: length 24.6
  Top Layer w0.254: 18.95,10.02 15.39,10.02 14.89,10.53 IMU1.13 ; 18.95,10.02 20.59,11.66 R9.1 19.7,18.15 17.81,18.15 17.24,18.72 U1.14 ; 18.95,10.02 17.39,8.46 CN1.5
SDA: length 20.4
  Top Layer w0.254: R8.1 15.28,19.89 15.27,19.9 ; v1(15.27,18.28) 15.27,19.9 ; 15.27,19.9 U1.13 ; IMU1.14 15.39,11.05 v1(15.52,10.91) ; v1(12.35,6.72) 12.35,4.98 12.39,4.94
  Bottom Layer w0.254: v1(15.27,18.28) 15.52,18.02 v1(15.52,10.91) 15.52,9.9 v1(12.35,6.72)
TX: length 28.3
  Top Layer w0.254: v1(28.47,42.66) 28.23,42.91 UART1.9 ; v1(21.24,22.09) U1.16
  Bottom Layer w0.254: v1(21.24,22.09) 21.24,36.31 27.59,42.66 v1(28.47,42.66)
$1N6016: length 12
  Top Layer w0.203: v1(16.16,44.44) 16.16,42.32 USB1.4 ; 7.88,43.57 7.88,44.16 v1(9.17,45.46)
  Bottom Layer w0.203: v1(9.17,45.46) 15.14,45.46 v1(16.16,44.44)
$1N6017: length 9.4
  Top Layer w0.203: 7.88,41.66 8.92,42.7 8.92,44.31 9.3,44.69 12.47,44.69 13.15,44.02 13.15,42.32
$1N6024: length 3.6
  Top Layer w0.254: 3.45,12.44 4.34,12.44 4.71,12.07 4.71,10.93 4.37,10.59 3.84,10.59
$1N6098: length 6.5
  Top Layer w0.254: 6.37,39.88 4.96,41.29 4.96,43.06 4.46,43.57 3.69,43.57 3.33,43.21 3.33,42.48
$1N22824: length 3.4
  Top Layer w0.254: UART1.5 21.38,41.41 20.98,41.01 20.98,40.5 21.49,39.99 R4.1
$1N30728: length 1.9
  Top Layer w0.508: L1.1 3.77,20.69 3.77,22.44
$1N30734: length 3.3
  Top Layer w0.254: FB1.2 FB2.1 2.37,25.7 1.87,25.2 1.87,25.04

## Copper pours and planes (outline as drawn; the poured copper is in the pictures)
GND on Top Layer: -2.13,54.34 30.76,54.34 30.76,-2.17 -2.13,-2.17
GND on Bottom Layer: -8.23,52.69 31.65,52.69 31.65,-2.3 -8.23,-2.3

Small or netless copper shapes (teardrops, artwork), in the pictures only: 1 on Top Layer

## Text on the board
Bottom Silkscreen Layer: SDA | GND | NC | 3V3 | SCL | JLCJLCJLCJLC | JST 5pin / 1.25mm | + | - | AUX | Before flashing, / board must connect / to battery | RARECHEESE | SlimeVR | CAUTION
Document Layer: Y | TP4057:2K | Any kind of modify are welcomed! / But please credit me on the / modified board with this logo | ↓↓↓↓
Top Solder Mask Layer: 7A7A | 5F71 | UP | ▲
Top Silkscreen Layer: R.CHEESE | rare cheese | 42688 | OSC | レア | チーズ
